# EAGLE schematic FranKinksTides-v1.4 (EAGLE 7.2.0)

## Sheet 1 of 7
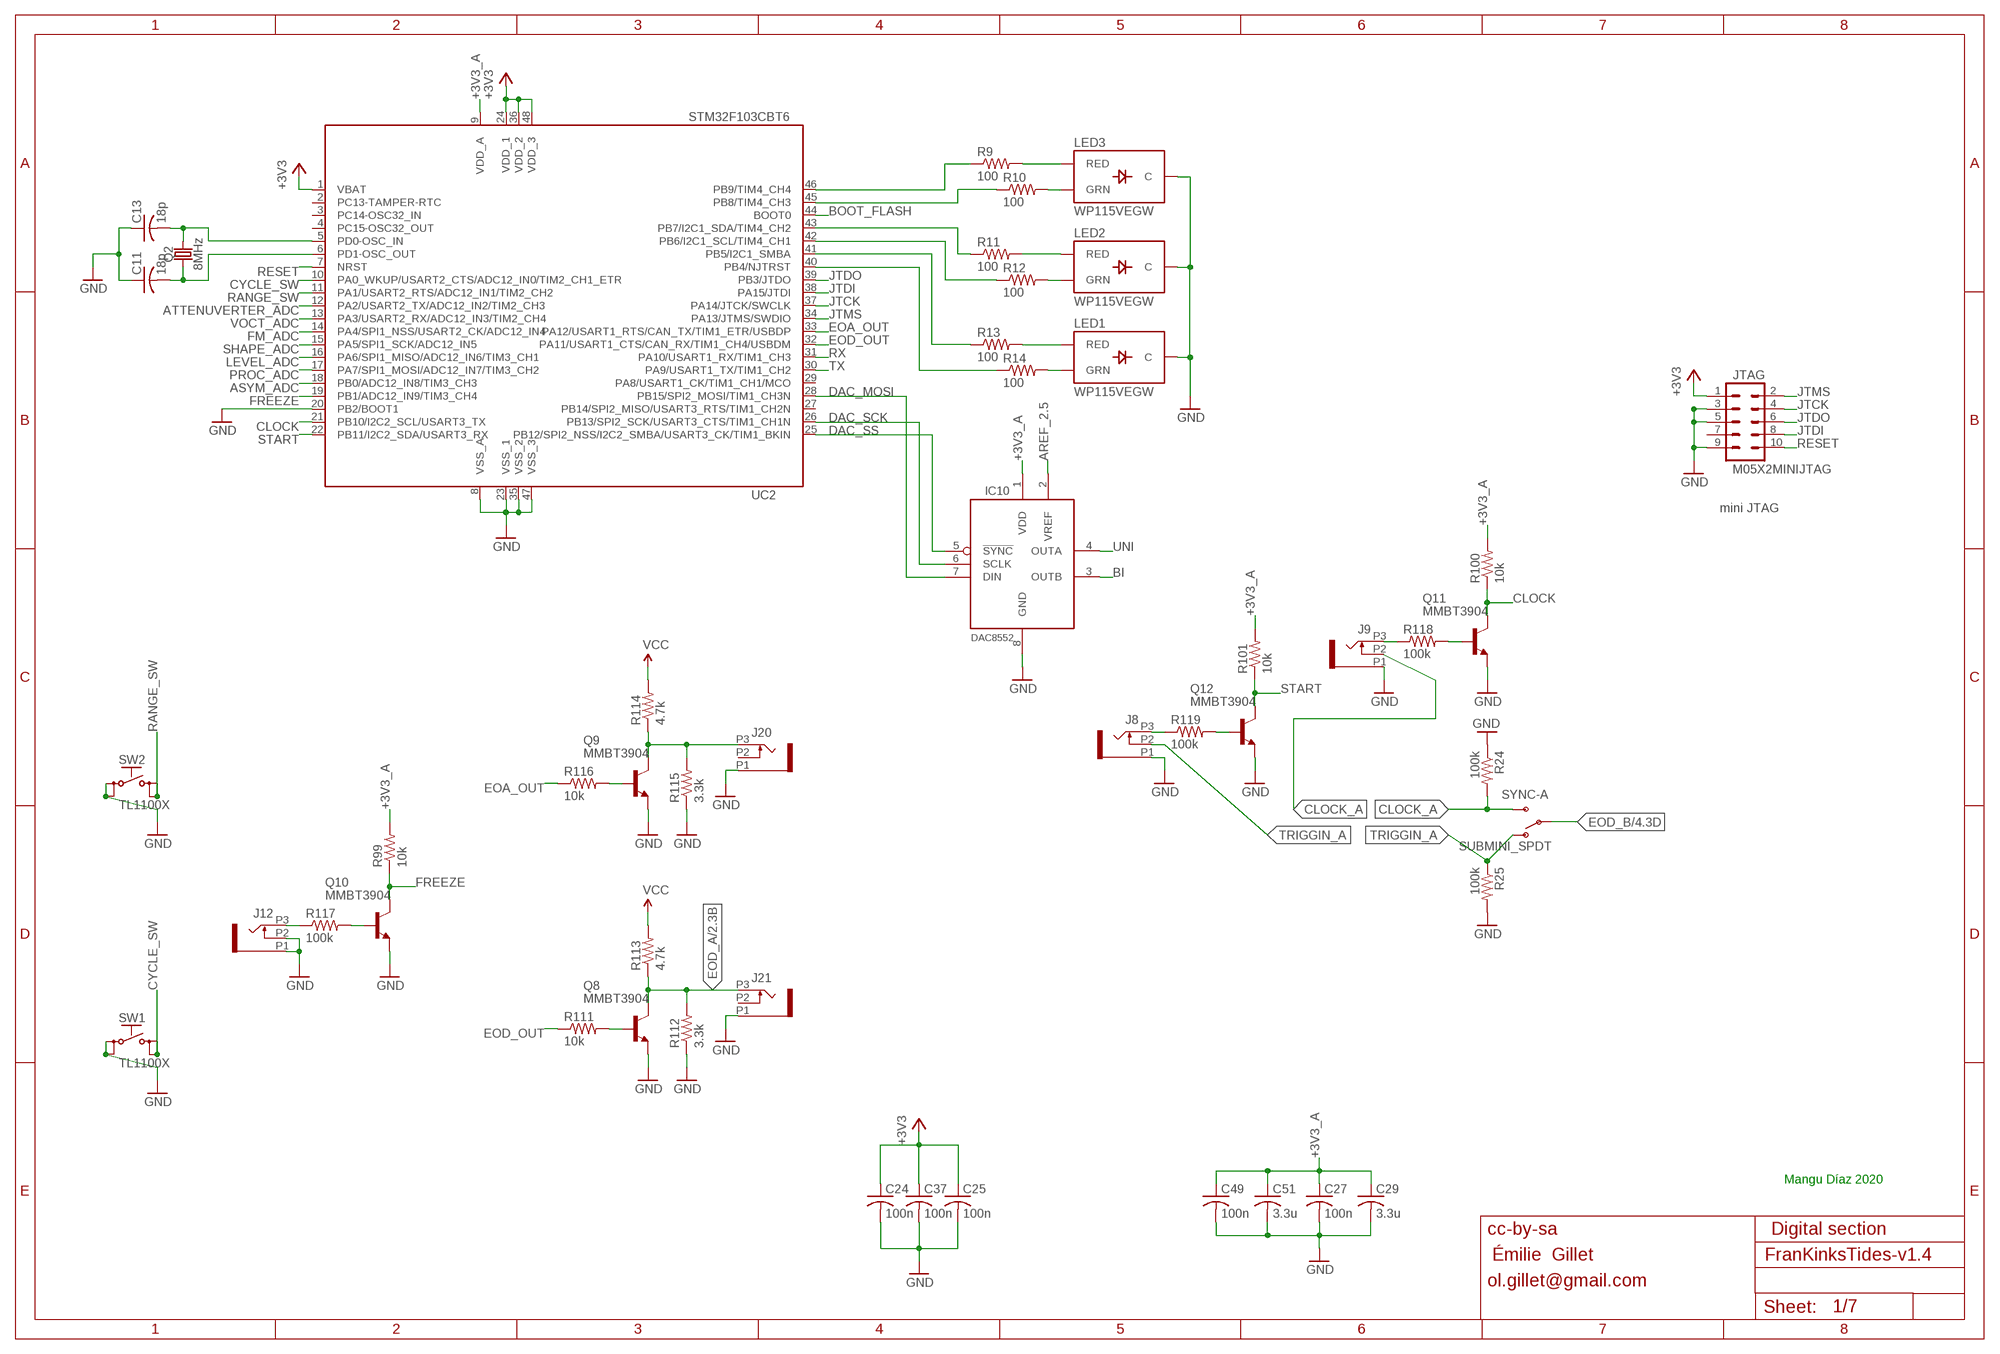
[diagram p0: schematic, sheet 1]

### Parts
C11  18p  C-USC0603  [C0603]
C13  18p  C-USC0603  [C0603]
C24  100n  C-USC0603  [C0603]
C25  100n  C-USC0603  [C0603]
C27  100n  C-USC0603  [C0603]
C29  3.3u  C-USC0603  [C0603]
C37  100n  C-USC0603  [C0603]
C49  100n  C-USC0603  [C0603]
C51  3.3u  C-USC0603  [C0603]
IC10  DAC8552  [MSOP-8]
J8  PJ301_GUI6  [OG-PJ301_VARIATIONS_WQP_PJ_301M6]
J9  PJ301_GUI6  [OG-PJ301_VARIATIONS_WQP_PJ_301M6]
J12  PJ301_GUI6  [OG-PJ301_VARIATIONS_WQP_PJ_301M6]
J20  PJ301_GUI6  [OG-PJ301_VARIATIONS_WQP_PJ_301M6]
J21  PJ301_GUI6  [OG-PJ301_VARIATIONS_WQP_PJ_301M6]
JTAG  M05X2MINIJTAG  [2X5-1.27]
LED1  WP115VEGW  LED-BICOLOR-THROUGHHOLE  [LED-BICOLOR-THROUGHHOLE]
LED2  WP115VEGW  LED-BICOLOR-THROUGHHOLE  [LED-BICOLOR-THROUGHHOLE]
LED3  WP115VEGW  LED-BICOLOR-THROUGHHOLE  [LED-BICOLOR-THROUGHHOLE]
Q2  8MHz  CRYSTAL-8MHZSMD-HC49UP  [HC49UP]
Q8  MMBT3904  MMBT3904LT1-NPN-SOT23-BEC  [SOT23-BEC]
Q9  MMBT3904  MMBT3904LT1-NPN-SOT23-BEC  [SOT23-BEC]
Q10  MMBT3904  MMBT3904LT1-NPN-SOT23-BEC  [SOT23-BEC]
Q11  MMBT3904  MMBT3904LT1-NPN-SOT23-BEC  [SOT23-BEC]
Q12  MMBT3904  MMBT3904LT1-NPN-SOT23-BEC  [SOT23-BEC]
R9  100  R-US_R0603  [R0603]
R10  100  R-US_R0603  [R0603]
R11  100  R-US_R0603  [R0603]
R12  100  R-US_R0603  [R0603]
R13  100  R-US_R0603  [R0603]
R14  100  R-US_R0603  [R0603]
R24  100k  R-US_R0603  [R0603]
R25  100k  R-US_R0603  [R0603]
R99  10k  R-US_R0603  [R0603]
R100  10k  R-US_R0603  [R0603]
R101  10k  R-US_R0603  [R0603]
R111  10k  R-US_R0603  [R0603]
R112  3.3k  R-US_R0603  [R0603]
R113  4.7k  R-US_R0603  [R0603]
R114  4.7k  R-US_R0603  [R0603]
R115  3.3k  R-US_R0603  [R0603]
R116  10k  R-US_R0603  [R0603]
R117  100k  R-US_R0603  [R0603]
R118  100k  R-US_R0603  [R0603]
R119  100k  R-US_R0603  [R0603]
SW1  TL1100X  [TL1100X]
SW2  TL1100X  [TL1100X]
SYNC-A  SUBMINI_SPDT  [SUBMINI_TOGGLE]
UC2  STM32F103CBT6  STM32F103CB  [LQFP48]

### Nets
+3V3: C24.1 C25.1 C37.1 JTAG.1 UC2.1(VBAT) UC2.24(VDD_1) UC2.36(VDD_2) UC2.48(VDD_3) ; also sheet 3,4,6
+3V3_A: C27.1 C29.1 C49.1 C51.1 IC10.1(VDD) R99.2 R100.2 R101.2 UC2.9(VDD_A) ; also sheet 2,3,4,5,6
AREF_2.5: IC10.2(VREF) ; also sheet 3,4,6
ASYM_ADC: UC2.18(PB0/ADC12_IN8/TIM3_CH3) ; also sheet 2,4,5
ATTENUVERTER_ADC: UC2.12(PA2/USART2_TX/ADC12_IN2/TIM2_CH3) ; also sheet 2,4,5
BI: IC10.3(OUTB) ; also sheet 2,4,5
BOOT_FLASH: UC2.44(BOOT0) ; also sheet 4
CLOCK: Q11.C R100.1 UC2.21(PB10/I2C2_SCL/USART3_TX) ; also sheet 4
CLOCK_A: J9.P2 R24.2 SYNC-A.3(S)
CYCLE_SW: SW1.3(S) SW1.4(S1) UC2.10(PA0_WKUP/USART2_CTS/ADC12_IN0/TIM2_CH1_ETR) ; also sheet 4
DAC_MOSI: IC10.7(DIN) UC2.28(PB15/SPI2_MOSI/TIM1_CH3N) ; also sheet 4
DAC_SCK: IC10.6(SCLK) UC2.26(PB13/SPI2_SCK/USART3_CTS/TIM1_CH1N) ; also sheet 4
DAC_SS: IC10.5(!SYNC) UC2.25(PB12/SPI2_NSS/I2C2_SMBA/USART3_CK/TIM1_BKIN) ; also sheet 4
EOA_OUT: R116.1 UC2.33(PA12/USART1_RTS/CAN_TX/TIM1_ETR/USBDP) ; also sheet 4
EOD_A: J21.P3 Q8.C R112.2 R113.1 ; also sheet 2
EOD_B: SYNC-A.COM(COMMON) ; also sheet 4
EOD_OUT: R111.1 UC2.32(PA11/USART1_CTS/CAN_RX/TIM1_CH4/USBDM) ; also sheet 4
FM_ADC: UC2.14(PA4/SPI1_NSS/USART2_CK/ADC12_IN4) ; also sheet 2,4,5
FREEZE: Q10.C R99.1 UC2.19(PB1/ADC12_IN9/TIM3_CH4) ; also sheet 4
GND: C11.1 C13.1 C24.2 C25.2 C27.2 C29.2 C37.2 C49.2 C51.2 IC10.8(GND) J8.P1 J9.P1 J12.P1 J12.P2 J20.P1 J21.P1 JTAG.3 JTAG.5 JTAG.9 LED1.2(C) LED2.2(C) LED3.2(C) Q8.E Q9.E Q10.E Q11.E Q12.E R24.1 R25.2 R112.1 R115.1 SW1.1(P) SW1.2(P1) SW2.1(P) SW2.2(P1) UC2.8(VSS_A) UC2.20(PB2/BOOT1) UC2.23(VSS_1) UC2.35(VSS_2) UC2.47(VSS_3) ; also sheet 2,3,4,5,6,7
JTCK: JTAG.4 UC2.37(PA14/JTCK/SWCLK) ; also sheet 4
JTDI: JTAG.8 UC2.38(PA15/JTDI) ; also sheet 4
JTDO: JTAG.6 UC2.39(PB3/JTDO) ; also sheet 4
JTMS: JTAG.2 UC2.34(PA13/JTMS/SWDIO) ; also sheet 4
LEVEL_ADC: UC2.16(PA6/SPI1_MISO/ADC12_IN6/TIM3_CH1) ; also sheet 2,4,5
N$7: C13.2 Q2.2 UC2.5(PD0-OSC_IN)
N$8: C11.2 Q2.1 UC2.6(PD1-OSC_OUT)
N$18: J8.P3 R119.1
N$21: J12.P3 R117.1
N$23: Q10.B R117.2
N$24: J9.P3 R118.1
N$25: Q11.B R118.2
N$26: Q8.B R111.2
N$28: LED3.3(RED) R9.2
N$29: LED3.1(GRN) R10.2
N$30: LED2.3(RED) R11.2
N$31: LED2.1(GRN) R12.2
N$32: LED1.3(RED) R13.2
N$33: LED1.1(GRN) R14.2
N$34: R9.1 UC2.46(PB9/TIM4_CH4)
N$35: R10.1 UC2.45(PB8/TIM4_CH3)
N$36: R11.1 UC2.43(PB7/I2C1_SDA/TIM4_CH2)
N$37: R12.1 UC2.42(PB6/I2C1_SCL/TIM4_CH1)
N$38: R13.1 UC2.41(PB5/I2C1_SMBA)
N$39: R14.1 UC2.40(PB4/NJTRST)
N$44: J20.P3 Q9.C R114.1 R115.2
N$47: Q9.B R116.2
N$66: Q12.B R119.2
PROC_ADC: UC2.17(PA7/SPI1_MOSI/ADC12_IN7/TIM3_CH2) ; also sheet 2,4,5
RANGE_SW: SW2.3(S) SW2.4(S1) UC2.11(PA1/USART2_RTS/ADC12_IN1/TIM2_CH2) ; also sheet 4
RESET: JTAG.10 UC2.7(NRST) ; also sheet 4
RX: UC2.31(PA10/USART1_RX/TIM1_CH3) ; also sheet 4
SHAPE_ADC: UC2.15(PA5/SPI1_SCK/ADC12_IN5) ; also sheet 2,4,5
START: Q12.C R101.1 UC2.22(PB11/I2C2_SDA/USART3_RX) ; also sheet 4
TRIGGIN_A: J8.P2 R25.1 SYNC-A.1(O)
TX: UC2.30(PA9/USART1_TX/TIM1_CH2) ; also sheet 4
UNI: IC10.4(OUTA) ; also sheet 2,4,5
VCC: R113.2 R114.2 ; also sheet 2,3,4,5,6,7
VOCT_ADC: UC2.13(PA3/USART2_RX/ADC12_IN3/TIM2_CH4) ; also sheet 2,4,5
Unconnected: J20.P2 J21.P2 JTAG.7 UC2.2(PC13-TAMPER-RTC) UC2.3(PC14-OSC32_IN) UC2.4(PC15-OSC32_OUT) UC2.27(PB14/SPI2_MISO/USART3_RTS/TIM1_CH2N) UC2.29(PA8/USART1_CK/TIM1_CH1/MCO)

### Notes on the sheet
- mini JTAG
- Mangu Díaz 2020
- cc-by-sa | Digital section
- Émilie  Gillet
- ol.gillet@gmail.com

## Sheet 2 of 7
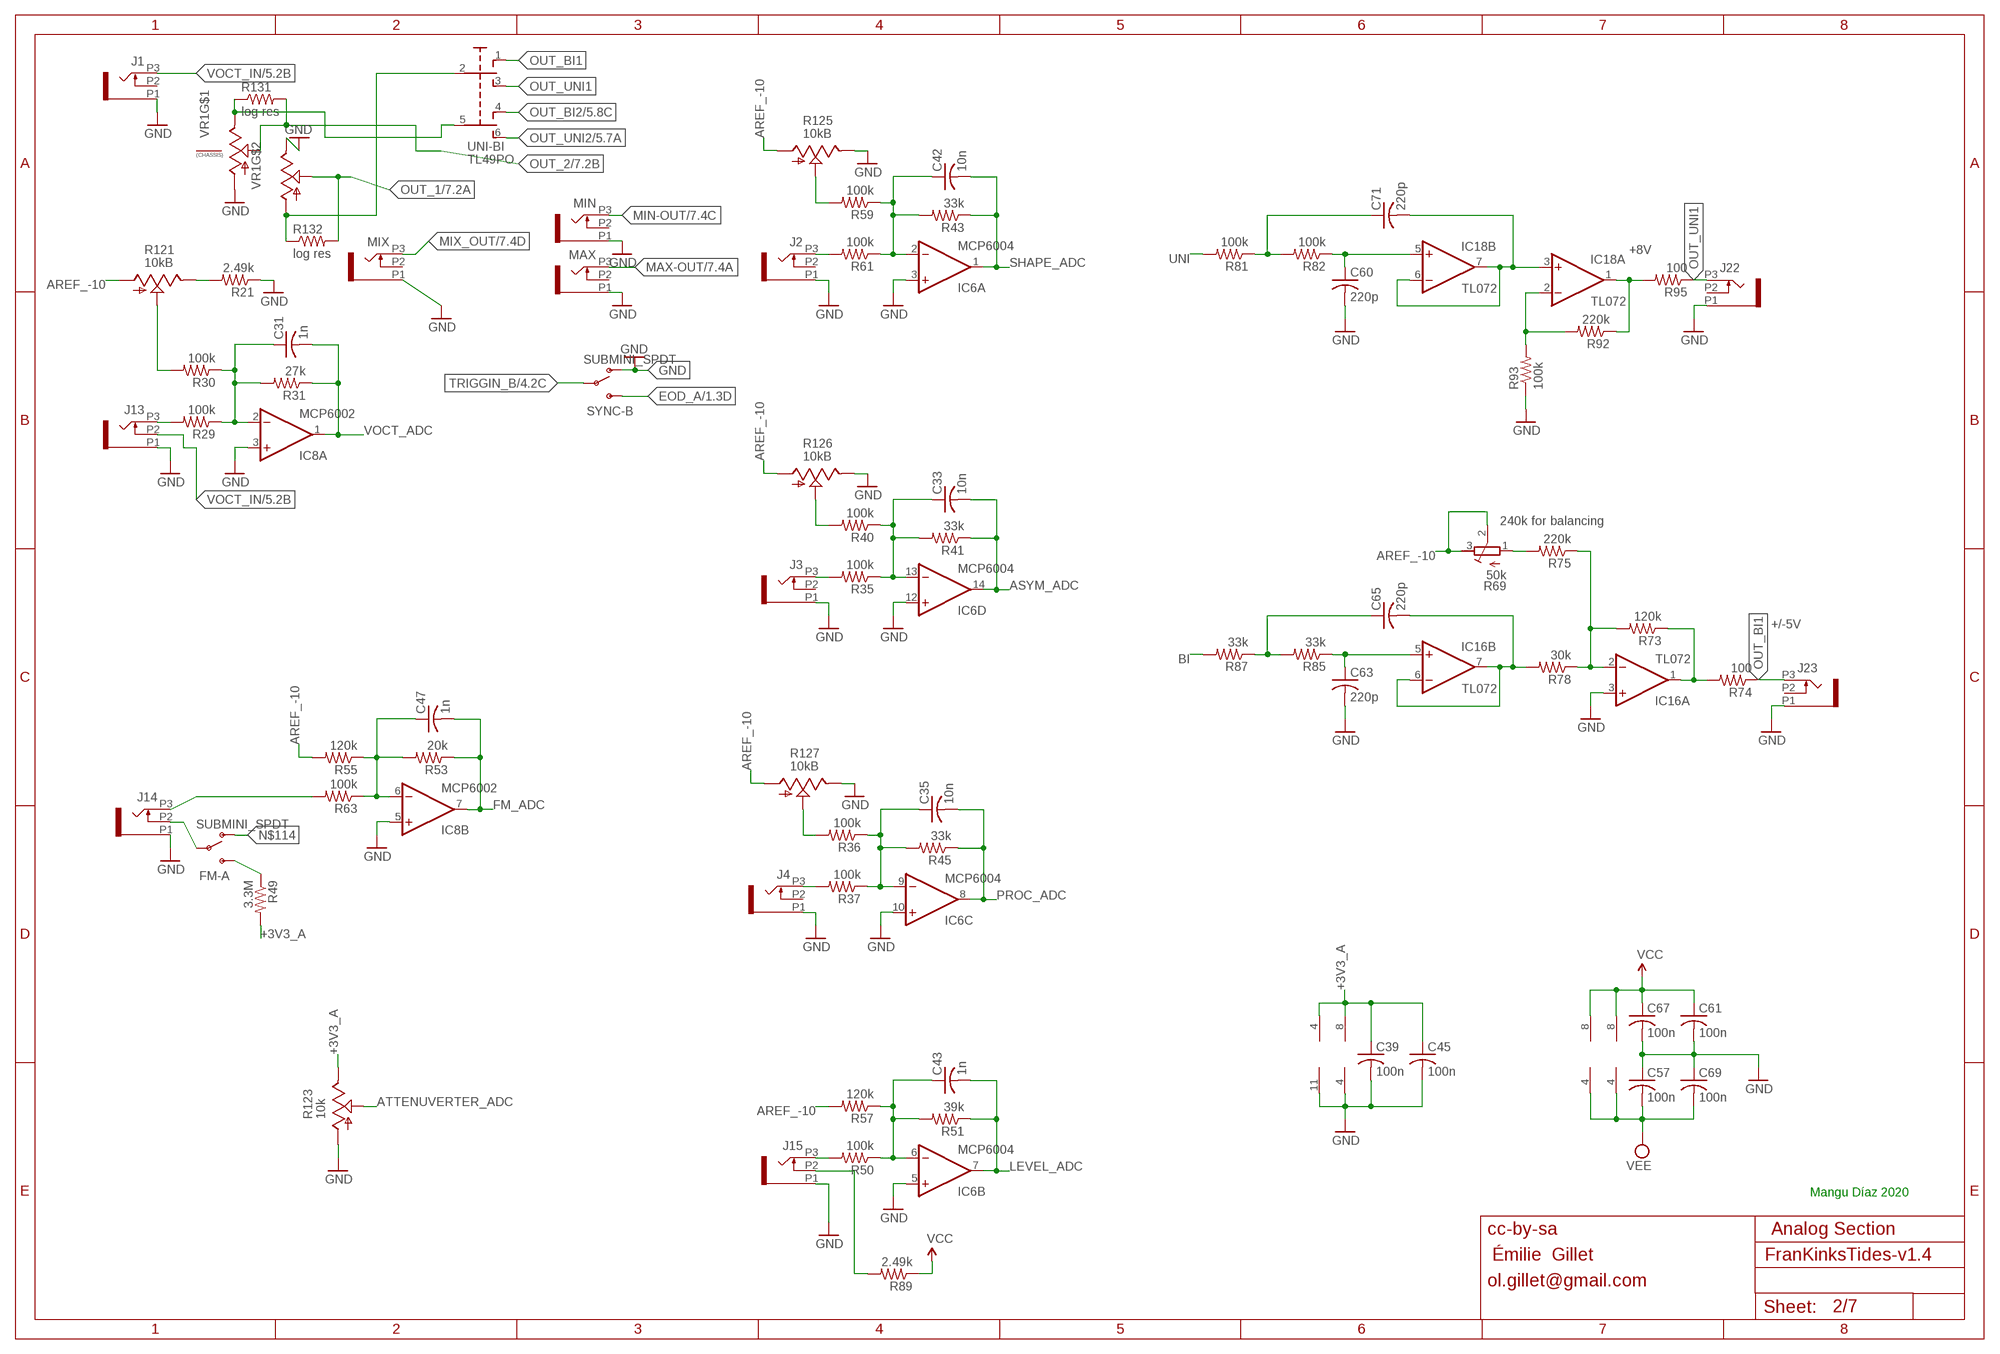
[diagram p1: schematic, sheet 2]

### Parts
C31  1n  C-USC0603  [C0603]
C33  10n  C-USC0603  [C0603]
C35  10n  C-USC0603  [C0603]
C39  100n  C-USC0603  [C0603]
C42  10n  C-USC0603  [C0603]
C43  1n  C-USC0603  [C0603]
C45  100n  C-USC0603  [C0603]
C47  1n  C-USC0603  [C0603]
C57  100n  C-USC0603  [C0603]
C60  220p  C-USC0603  [C0603]
C61  100n  C-USC0603  [C0603]
C63  220p  C-USC0603  [C0603]
C65  220p  C-USC0603  [C0603]
C67  100n  C-USC0603  [C0603]
C69  100n  C-USC0603  [C0603]
C71  220p  C-USC0603  [C0603]
FM-A  SUBMINI_SPDT  [SUBMINI_TOGGLE]
IC6  MCP6004  MCP6004ST  [TSSOP14]
IC8  MCP6002  TL072D  [SO08]
IC16  TL072  TL072TSSOP  [TSSOP-8]
IC18  TL072  TL072TSSOP  [TSSOP-8]
J1  PJ301_GUI6  [OG-PJ301_VARIATIONS_WQP_PJ_301M6]
J2  PJ301_GUI6  [OG-PJ301_VARIATIONS_WQP_PJ_301M6]
J3  PJ301_GUI6  [OG-PJ301_VARIATIONS_WQP_PJ_301M6]
J4  PJ301_GUI6  [OG-PJ301_VARIATIONS_WQP_PJ_301M6]
J13  PJ301_GUI6  [OG-PJ301_VARIATIONS_WQP_PJ_301M6]
J14  PJ301_GUI6  [OG-PJ301_VARIATIONS_WQP_PJ_301M6]
J15  PJ301_GUI6  [OG-PJ301_VARIATIONS_WQP_PJ_301M6]
J22  PJ301_GUI6  [OG-PJ301_VARIATIONS_WQP_PJ_301M6]
J23  PJ301_GUI6  [OG-PJ301_VARIATIONS_WQP_PJ_301M6]
MAX  PJ301_GUI6  [OG-PJ301_VARIATIONS_WQP_PJ_301M6]
MIN  PJ301_GUI6  [OG-PJ301_VARIATIONS_WQP_PJ_301M6]
MIX  PJ301_GUI6  [OG-PJ301_VARIATIONS_WQP_PJ_301M6]
R21  2.49k  R-US_R0603  [R0603]
R29  100k  R-US_R0603  [R0603]
R30  100k  R-US_R0603  [R0603]
R31  27k  R-US_R0603  [R0603]
R35  100k  R-US_R0603  [R0603]
R36  100k  R-US_R0603  [R0603]
R37  100k  R-US_R0603  [R0603]
R40  100k  R-US_R0603  [R0603]
R41  33k  R-US_R0603  [R0603]
R43  33k  R-US_R0603  [R0603]
R45  33k  R-US_R0603  [R0603]
R49  3.3M  R-US_R0603  [R0603]
R50  100k  R-US_R0603  [R0603]
R51  39k  R-US_R0603  [R0603]
R53  20k  R-US_R0603  [R0603]
R55  120k  R-US_R0603  [R0603]
R57  120k  R-US_R0603  [R0603]
R59  100k  R-US_R0603  [R0603]
R61  100k  R-US_R0603  [R0603]
R63  100k  R-US_R0603  [R0603]
R69  50k  R-TRIMM3296W  [RTRIM3296W]
R73  120k  R-US_R0603  [R0603]
R74  100  R-US_R0603  [R0603]
R75  220k  R-US_R0603  [R0603]
R78  30k  R-US_R0603  [R0603]
R81  100k  R-US_R0603  [R0603]
R82  100k  R-US_R0603  [R0603]
R85  33k  R-US_R0603  [R0603]
R87  33k  R-US_R0603  [R0603]
R89  2.49k  R-US_R0805  [R0805]
R92  220k  R-US_R0603  [R0603]
R93  100k  R-US_R0603  [R0603]
R95  100  R-US_R0603  [R0603]
R121  10kB  POT_USVERTICAL_PS  [ALPS_POT_VERTICAL_PS]
R123  10k  POT-ALPS_POT_US  [TALLTRIMMER]
R125  10kB  POT-ALPS_POT_US  [TALLTRIMMER]
R126  10kB  POT-ALPS_POT_US  [TALLTRIMMER]
R127  10kB  POT-ALPS_POT_US  [TALLTRIMMER]
R131  log res  R-US_R0603  [R0603]
R132  log res  R-US_R0603  [R0603]
SYNC-B  SUBMINI_SPDT  [SUBMINI_TOGGLE]
UNI-BI  TL49PO  [TL4XPO]
VR1  ALPHA-9MM-DUALPOT  [DUAL_9MM_SNAP-IN_POT]

### Nets
+3V3_A: C39.1 C45.1 IC6.4(P:V+) IC8.8(P:V+) R49.2 R123.P$1(E) ; also sheet 1,3,4,5,6
AREF_-10: R55.2 R57.2 R69.2(S) R69.3(E) R121.P$3(A) R125.P$3(A) R126.P$3(A) R127.P$3(A) ; also sheet 3,5,6
ASYM_ADC: C33.2 IC6.14(D:OUT) R41.1 ; also sheet 1,4,5
ATTENUVERTER_ADC: R123.P$2(S) ; also sheet 1,4,5
BI: R87.2 ; also sheet 1,4,5
BI_OUT: IC16.1(A:OUT) R73.1 R74.2
EOD_A: SYNC-B.3(S) ; also sheet 1
F_CV: IC16.2(A:-IN) R73.2 R75.1 R78.1
FM_ADC: C47.2 IC8.7(B:OUT) R53.1 ; also sheet 1,4,5
GND: C39.2 C45.2 C57.1 C60.2 C61.2 C63.2 C67.2 C69.1 IC6.3(A:+IN) IC6.5(B:+IN) IC6.10(C:+IN) IC6.11(P:V-) IC6.12(D:+IN) IC8.3(A:+IN) IC8.4(P:V-) IC8.5(B:+IN) IC16.3(A:+IN) J1.P1 J2.P1 J3.P1 J4.P1 J13.P1 J14.P1 J15.P1 J22.P1 J23.P1 MAX.P1 MIN.P1 MIX.P1 R21.1 R93.1 R123.P$3(A) R125.P$1(E) R126.P$1(E) R127.P$1(E) SYNC-B.1(O) VR1.1(A) VR1.3B(E) ; also sheet 1,3,4,5,6,7
LEVEL_ADC: C43.2 IC6.7(B:OUT) R51.1 ; also sheet 1,4,5
MAX-OUT: MAX.P3 ; also sheet 7
MIN-OUT: MIN.P3 ; also sheet 7
MIX_OUT: MIX.P3 ; also sheet 7
N$1: J2.P3 R61.2
N$2: C42.1 IC6.2(A:-IN) R43.2 R59.1 R61.1
N$3: R59.2 R125.P$2(S)
N$4: J3.P3 R35.2
N$5: C33.1 IC6.13(D:-IN) R35.1 R40.1 R41.2
N$6: FM-A.3(S) R49.1
N$9: R40.2 R126.P$2(S)
N$10: J4.P3 R37.2
N$11: C35.1 IC6.9(C:-IN) R36.1 R37.1 R45.2
N$12: R36.2 R127.P$2(S)
N$13: J15.P3 R50.2
N$14: C43.1 IC6.6(B:-IN) R50.1 R51.2 R57.1
N$15: J13.P3 R29.2
N$16: C31.1 IC8.2(A:-IN) R29.1 R30.1 R31.2
N$17: R30.2 R121.P$2(S)
N$19: R21.2 R121.P$1(E)
N$20: J14.P3 R63.2
N$22: C47.1 IC8.6(B:-IN) R53.2 R55.1 R63.1
N$27: FM-A.COM(COMMON) J14.P2
N$40: R69.1(A) R75.2
N$41: IC18.2(A:-IN) R92.2 R93.2
N$42: C65.2 IC16.6(B:-IN) IC16.7(B:OUT) R78.2
N$43: C63.1 IC16.5(B:+IN) R85.1
N$45: C65.1 R85.2 R87.1
N$46: IC18.1(A:OUT) R92.1 R95.2
N$48: J15.P2 R89.2
N$67: C71.2 IC18.3(A:+IN) IC18.6(B:-IN) IC18.7(B:OUT)
N$69: C60.1 IC18.5(B:+IN) R82.1
N$71: C71.1 R81.1 R82.2
N$114: FM-A.1(O) R131.1 UNI-BI.5(P1) VR1.3(E)
N$116: R132.1 UNI-BI.2(P) VR1.1B(A)
OUT_1: R132.2 VR1.2B(S) ; also sheet 7
OUT_2: R131.2 VR1.2(S) ; also sheet 7
OUT_BI1: J23.P3 R74.1 UNI-BI.1(O)
OUT_BI2: UNI-BI.4(O1) ; also sheet 5
OUT_UNI1: J22.P3 R95.1 UNI-BI.3(S)
OUT_UNI2: UNI-BI.6(S1) ; also sheet 5
PROC_ADC: C35.2 IC6.8(C:OUT) R45.1 ; also sheet 1,4,5
SHAPE_ADC: C42.2 IC6.1(A:OUT) R43.1 ; also sheet 1,4,5
TRIGGIN_B: SYNC-B.COM(COMMON) ; also sheet 4
UNI: R81.2 ; also sheet 1,4,5
VCC: C61.1 C67.1 IC16.8(P:V+) IC18.8(P:V+) R89.1 ; also sheet 1,3,4,5,6,7
VEE: C57.2 C69.2 IC16.4(P:V-) IC18.4(P:V-) ; also sheet 3,5,6,7
VOCT_ADC: C31.2 IC8.1(A:OUT) R31.1 ; also sheet 1,4,5
VOCT_IN: J1.P3 J13.P2 ; also sheet 5
Unconnected: J1.P2 J2.P2 J3.P2 J4.P2 J22.P2 J23.P2 MAX.P2 MIN.P2 MIX.P2 VR1.CHASSIS1 VR1.CHASSIS2

### Notes on the sheet
- +8V
- 240k for balancing
- +/-5V
- Mangu Díaz 2020
- cc-by-sa | Analog Section
- Émilie  Gillet
- ol.gillet@gmail.com

## Sheet 3 of 7
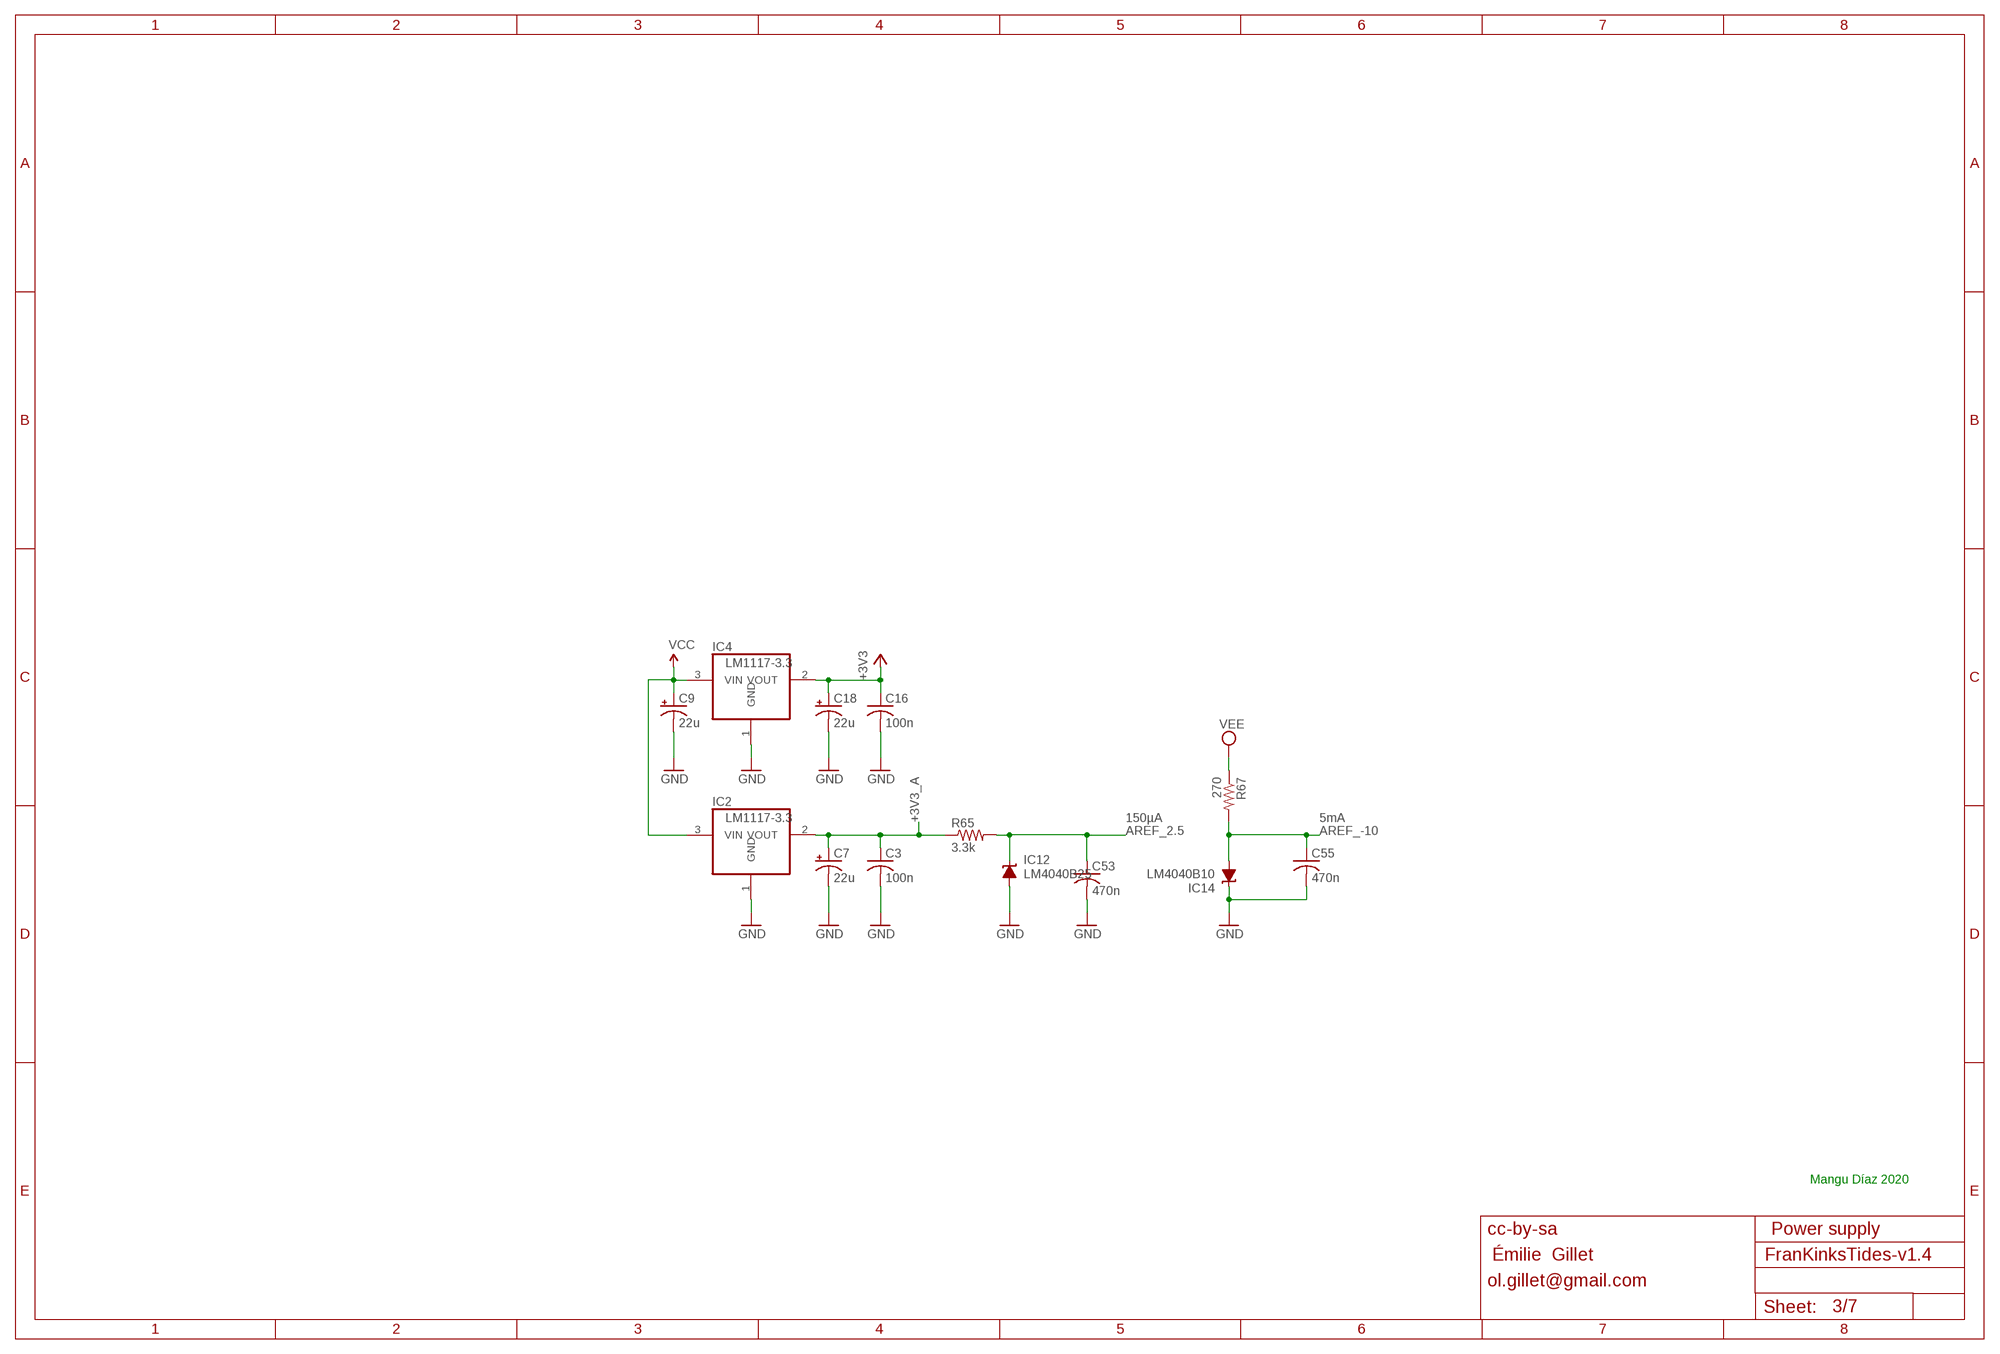
[diagram p2: schematic, sheet 3]

### Parts
C3  100n  C-USC0603  [C0603]
C7  22u  CPOL-USD  [PANASONIC_D]
C9  22u  CPOL-USD  [PANASONIC_D]
C16  100n  C-USC0603  [C0603]
C18  22u  CPOL-USD  [PANASONIC_D]
C53  470n  C-USC0603  [C0603]
C55  470n  C-USC0603  [C0603]
IC2  LM1117-3.3  REG1117  [SOT223]
IC4  LM1117-3.3  REG1117  [SOT223]
IC12  LM4040B25  LM4041B12DBZ  [DBZ_R-PDSO-G3]
IC14  LM4040B10  LM4041B12DBZ  [DBZ_R-PDSO-G3]
R65  3.3k  R-US_R0603  [R0603]
R67  270  R-US_R0603  [R0603]

### Nets
+3V3: C16.1 C18.+ IC4.2(VOUT) ; also sheet 1,4,6
+3V3_A: C3.1 C7.+ IC2.2(VOUT) R65.1 ; also sheet 1,2,4,5,6
AREF_2.5: C53.1 IC12.1(C) R65.2 ; also sheet 1,4,6
AREF_-10: C55.1 IC14.2(A) R67.2 ; also sheet 2,5,6
GND: C3.2 C7.- C9.- C16.2 C18.- C53.2 C55.2 IC2.1(GND) IC4.1(GND) IC12.2(A) IC14.1(C) ; also sheet 1,2,4,5,6,7
VCC: C9.+ IC2.3(VIN) IC4.3(VIN) ; also sheet 1,2,4,5,6,7
VEE: R67.1 ; also sheet 2,5,6,7

### Notes on the sheet
- 150µA | 5mA
- Mangu Díaz 2020
- cc-by-sa | Power supply
- Émilie  Gillet
- ol.gillet@gmail.com

## Sheet 4 of 7
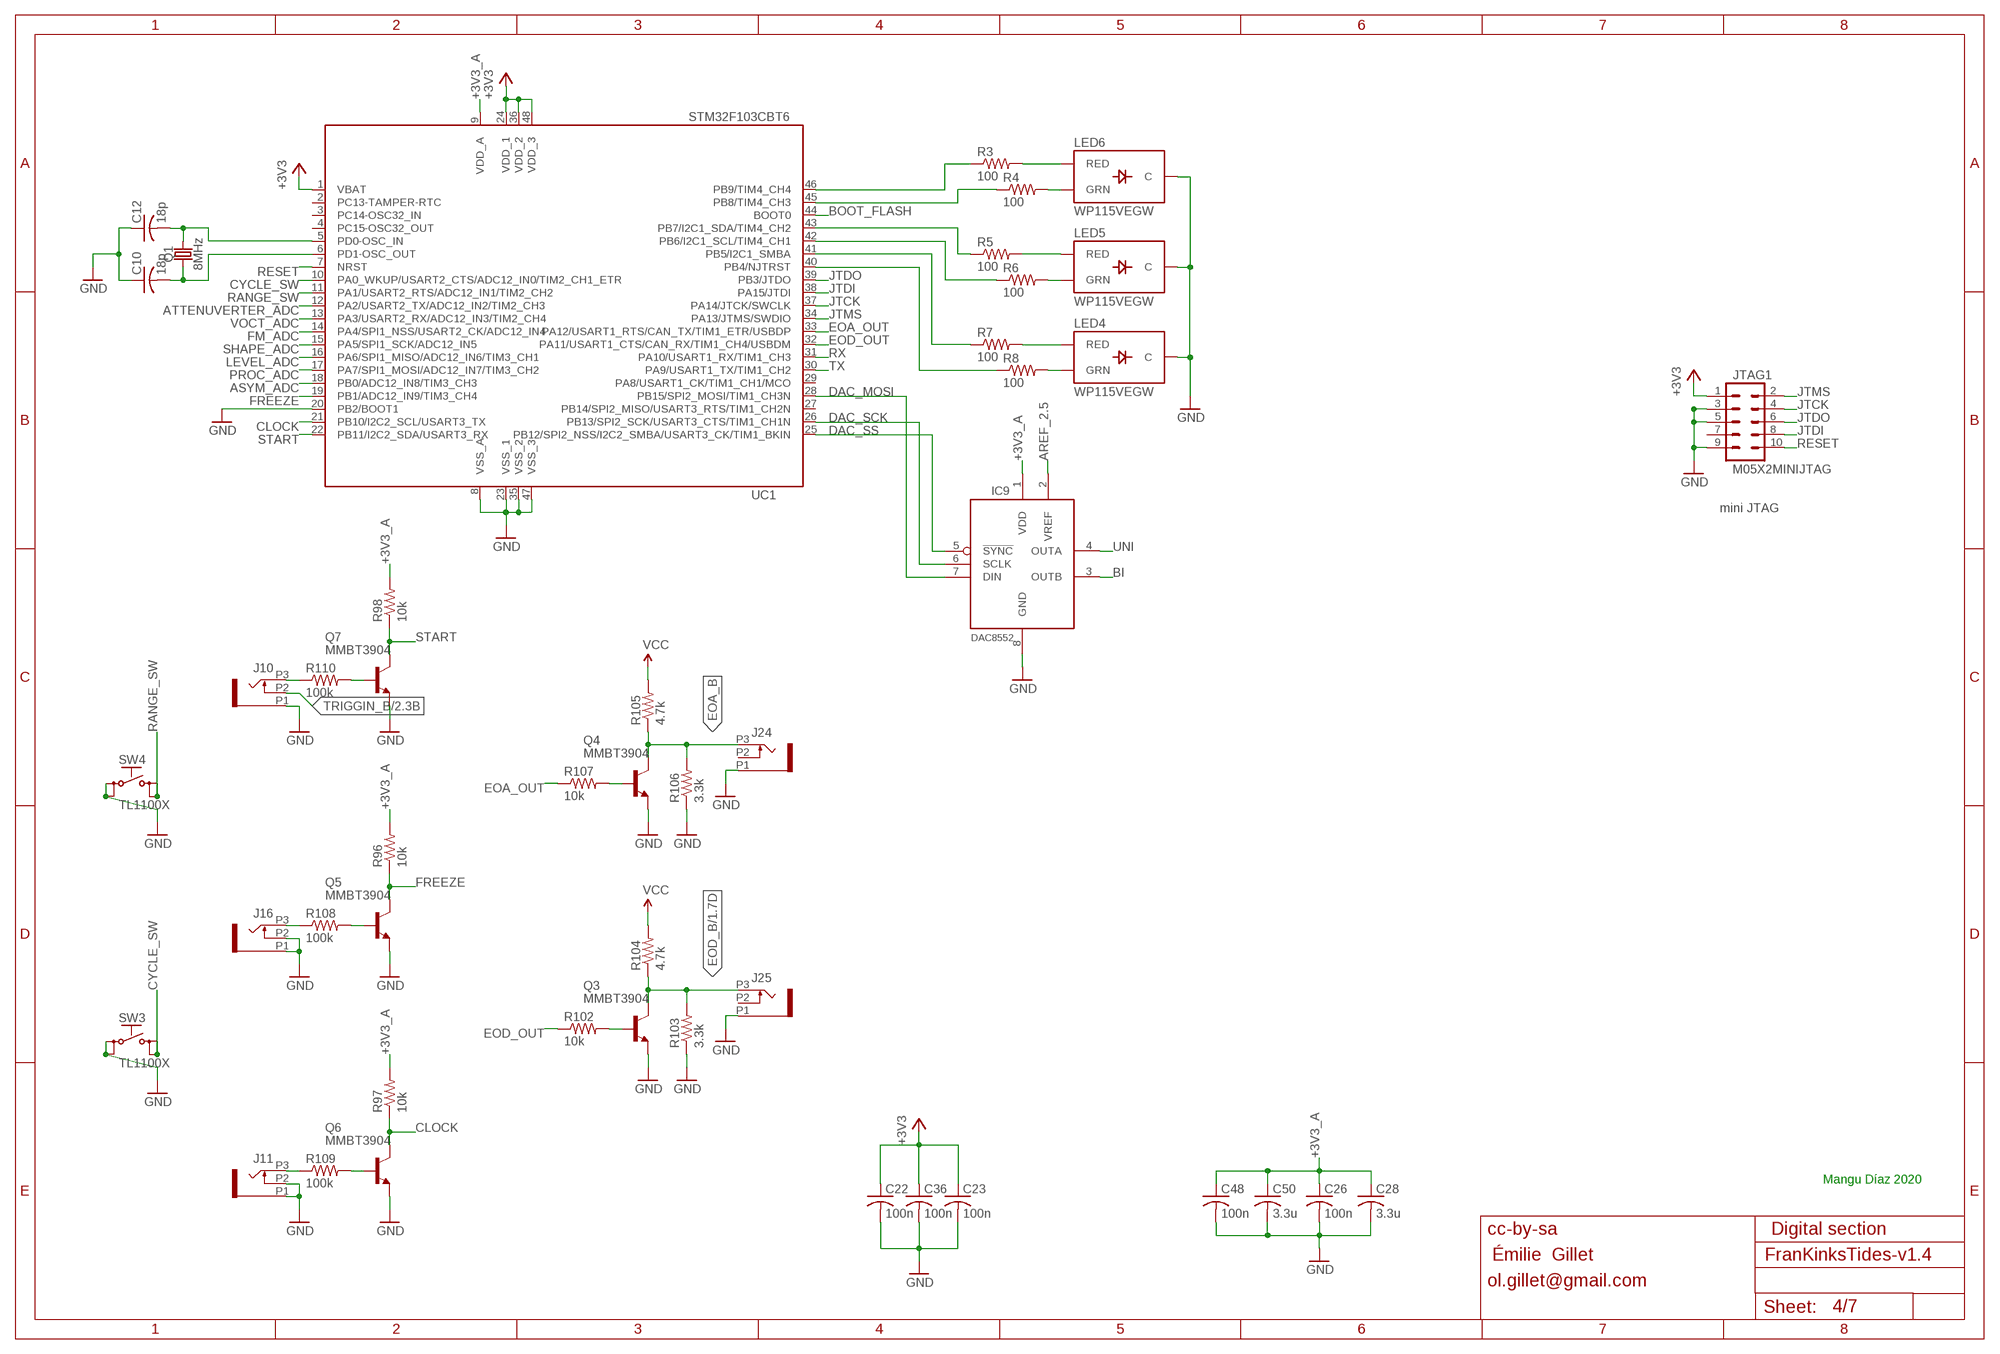
[diagram p3: schematic, sheet 4]

### Parts
C10  18p  C-USC0603  [C0603]
C12  18p  C-USC0603  [C0603]
C22  100n  C-USC0603  [C0603]
C23  100n  C-USC0603  [C0603]
C26  100n  C-USC0603  [C0603]
C28  3.3u  C-USC0603  [C0603]
C36  100n  C-USC0603  [C0603]
C48  100n  C-USC0603  [C0603]
C50  3.3u  C-USC0603  [C0603]
IC9  DAC8552  [MSOP-8]
J10  PJ301_GUI6  [OG-PJ301_VARIATIONS_WQP_PJ_301M6]
J11  PJ301_GUI6  [OG-PJ301_VARIATIONS_WQP_PJ_301M6]
J16  PJ301_GUI6  [OG-PJ301_VARIATIONS_WQP_PJ_301M6]
J24  PJ301_GUI6  [OG-PJ301_VARIATIONS_WQP_PJ_301M6]
J25  PJ301_GUI6  [OG-PJ301_VARIATIONS_WQP_PJ_301M6]
JTAG1  M05X2MINIJTAG  [2X5-1.27]
LED4  WP115VEGW  LED-BICOLOR-THROUGHHOLE  [LED-BICOLOR-THROUGHHOLE]
LED5  WP115VEGW  LED-BICOLOR-THROUGHHOLE  [LED-BICOLOR-THROUGHHOLE]
LED6  WP115VEGW  LED-BICOLOR-THROUGHHOLE  [LED-BICOLOR-THROUGHHOLE]
Q1  8MHz  CRYSTAL-8MHZSMD-HC49UP  [HC49UP]
Q3  MMBT3904  MMBT3904LT1-NPN-SOT23-BEC  [SOT23-BEC]
Q4  MMBT3904  MMBT3904LT1-NPN-SOT23-BEC  [SOT23-BEC]
Q5  MMBT3904  MMBT3904LT1-NPN-SOT23-BEC  [SOT23-BEC]
Q6  MMBT3904  MMBT3904LT1-NPN-SOT23-BEC  [SOT23-BEC]
Q7  MMBT3904  MMBT3904LT1-NPN-SOT23-BEC  [SOT23-BEC]
R3  100  R-US_R0603  [R0603]
R4  100  R-US_R0603  [R0603]
R5  100  R-US_R0603  [R0603]
R6  100  R-US_R0603  [R0603]
R7  100  R-US_R0603  [R0603]
R8  100  R-US_R0603  [R0603]
R96  10k  R-US_R0603  [R0603]
R97  10k  R-US_R0603  [R0603]
R98  10k  R-US_R0603  [R0603]
R102  10k  R-US_R0603  [R0603]
R103  3.3k  R-US_R0603  [R0603]
R104  4.7k  R-US_R0603  [R0603]
R105  4.7k  R-US_R0603  [R0603]
R106  3.3k  R-US_R0603  [R0603]
R107  10k  R-US_R0603  [R0603]
R108  100k  R-US_R0603  [R0603]
R109  100k  R-US_R0603  [R0603]
R110  100k  R-US_R0603  [R0603]
SW3  TL1100X  [TL1100X]
SW4  TL1100X  [TL1100X]
UC1  STM32F103CBT6  STM32F103CB  [LQFP48]

### Nets
+3V3: C22.1 C23.1 C36.1 JTAG1.1 UC1.1(VBAT) UC1.24(VDD_1) UC1.36(VDD_2) UC1.48(VDD_3) ; also sheet 1,3,6
+3V3_A: C26.1 C28.1 C48.1 C50.1 IC9.1(VDD) R96.2 R97.2 R98.2 UC1.9(VDD_A) ; also sheet 1,2,3,5,6
AREF_2.5: IC9.2(VREF) ; also sheet 1,3,6
ASYM_ADC: UC1.18(PB0/ADC12_IN8/TIM3_CH3) ; also sheet 1,2,5
ATTENUVERTER_ADC: UC1.12(PA2/USART2_TX/ADC12_IN2/TIM2_CH3) ; also sheet 1,2,5
BI: IC9.3(OUTB) ; also sheet 1,2,5
BOOT_FLASH: UC1.44(BOOT0) ; also sheet 1
CLOCK: Q6.C R97.1 UC1.21(PB10/I2C2_SCL/USART3_TX) ; also sheet 1
CYCLE_SW: SW3.3(S) SW3.4(S1) UC1.10(PA0_WKUP/USART2_CTS/ADC12_IN0/TIM2_CH1_ETR) ; also sheet 1
DAC_MOSI: IC9.7(DIN) UC1.28(PB15/SPI2_MOSI/TIM1_CH3N) ; also sheet 1
DAC_SCK: IC9.6(SCLK) UC1.26(PB13/SPI2_SCK/USART3_CTS/TIM1_CH1N) ; also sheet 1
DAC_SS: IC9.5(!SYNC) UC1.25(PB12/SPI2_NSS/I2C2_SMBA/USART3_CK/TIM1_BKIN) ; also sheet 1
EOA_B: J24.P3 Q4.C R105.1 R106.2
EOA_OUT: R107.1 UC1.33(PA12/USART1_RTS/CAN_TX/TIM1_ETR/USBDP) ; also sheet 1
EOD_B: J25.P3 Q3.C R103.2 R104.1 ; also sheet 1
EOD_OUT: R102.1 UC1.32(PA11/USART1_CTS/CAN_RX/TIM1_CH4/USBDM) ; also sheet 1
FM_ADC: UC1.14(PA4/SPI1_NSS/USART2_CK/ADC12_IN4) ; also sheet 1,2,5
FREEZE: Q5.C R96.1 UC1.19(PB1/ADC12_IN9/TIM3_CH4) ; also sheet 1
GND: C10.1 C12.1 C22.2 C23.2 C26.2 C28.2 C36.2 C48.2 C50.2 IC9.8(GND) J10.P1 J11.P1 J11.P2 J16.P1 J16.P2 J24.P1 J25.P1 JTAG1.3 JTAG1.5 JTAG1.9 LED4.2(C) LED5.2(C) LED6.2(C) Q3.E Q4.E Q5.E Q6.E Q7.E R103.1 R106.1 SW3.1(P) SW3.2(P1) SW4.1(P) SW4.2(P1) UC1.8(VSS_A) UC1.20(PB2/BOOT1) UC1.23(VSS_1) UC1.35(VSS_2) UC1.47(VSS_3) ; also sheet 1,2,3,5,6,7
JTCK: JTAG1.4 UC1.37(PA14/JTCK/SWCLK) ; also sheet 1
JTDI: JTAG1.8 UC1.38(PA15/JTDI) ; also sheet 1
JTDO: JTAG1.6 UC1.39(PB3/JTDO) ; also sheet 1
JTMS: JTAG1.2 UC1.34(PA13/JTMS/SWDIO) ; also sheet 1
LEVEL_ADC: UC1.16(PA6/SPI1_MISO/ADC12_IN6/TIM3_CH1) ; also sheet 1,2,5
N$49: C12.2 Q1.2 UC1.5(PD0-OSC_IN)
N$50: C10.2 Q1.1 UC1.6(PD1-OSC_OUT)
N$51: Q4.B R107.2
N$53: Q3.B R102.2
N$55: LED6.3(RED) R3.2
N$58: LED6.1(GRN) R4.2
N$59: LED5.3(RED) R5.2
N$60: LED5.1(GRN) R6.2
N$61: LED4.3(RED) R7.2
N$62: LED4.1(GRN) R8.2
N$63: R3.1 UC1.46(PB9/TIM4_CH4)
N$65: R4.1 UC1.45(PB8/TIM4_CH3)
N$68: R5.1 UC1.43(PB7/I2C1_SDA/TIM4_CH2)
N$70: R6.1 UC1.42(PB6/I2C1_SCL/TIM4_CH1)
N$72: R7.1 UC1.41(PB5/I2C1_SMBA)
N$73: R8.1 UC1.40(PB4/NJTRST)
N$74: J10.P3 R110.1
N$75: Q7.B R110.2
N$76: J16.P3 R108.1
N$77: Q5.B R108.2
N$78: J11.P3 R109.1
N$79: Q6.B R109.2
PROC_ADC: UC1.17(PA7/SPI1_MOSI/ADC12_IN7/TIM3_CH2) ; also sheet 1,2,5
RANGE_SW: SW4.3(S) SW4.4(S1) UC1.11(PA1/USART2_RTS/ADC12_IN1/TIM2_CH2) ; also sheet 1
RESET: JTAG1.10 UC1.7(NRST) ; also sheet 1
RX: UC1.31(PA10/USART1_RX/TIM1_CH3) ; also sheet 1
SHAPE_ADC: UC1.15(PA5/SPI1_SCK/ADC12_IN5) ; also sheet 1,2,5
START: Q7.C R98.1 UC1.22(PB11/I2C2_SDA/USART3_RX) ; also sheet 1
TRIGGIN_B: J10.P2 ; also sheet 2
TX: UC1.30(PA9/USART1_TX/TIM1_CH2) ; also sheet 1
UNI: IC9.4(OUTA) ; also sheet 1,2,5
VCC: R104.2 R105.2 ; also sheet 1,2,3,5,6,7
VOCT_ADC: UC1.13(PA3/USART2_RX/ADC12_IN3/TIM2_CH4) ; also sheet 1,2,5
Unconnected: J24.P2 J25.P2 JTAG1.7 UC1.2(PC13-TAMPER-RTC) UC1.3(PC14-OSC32_IN) UC1.4(PC15-OSC32_OUT) UC1.27(PB14/SPI2_MISO/USART3_RTS/TIM1_CH2N) UC1.29(PA8/USART1_CK/TIM1_CH1/MCO)

### Notes on the sheet
- mini JTAG
- Mangu Díaz 2020
- cc-by-sa | Digital section
- Émilie  Gillet
- ol.gillet@gmail.com

## Sheet 5 of 7
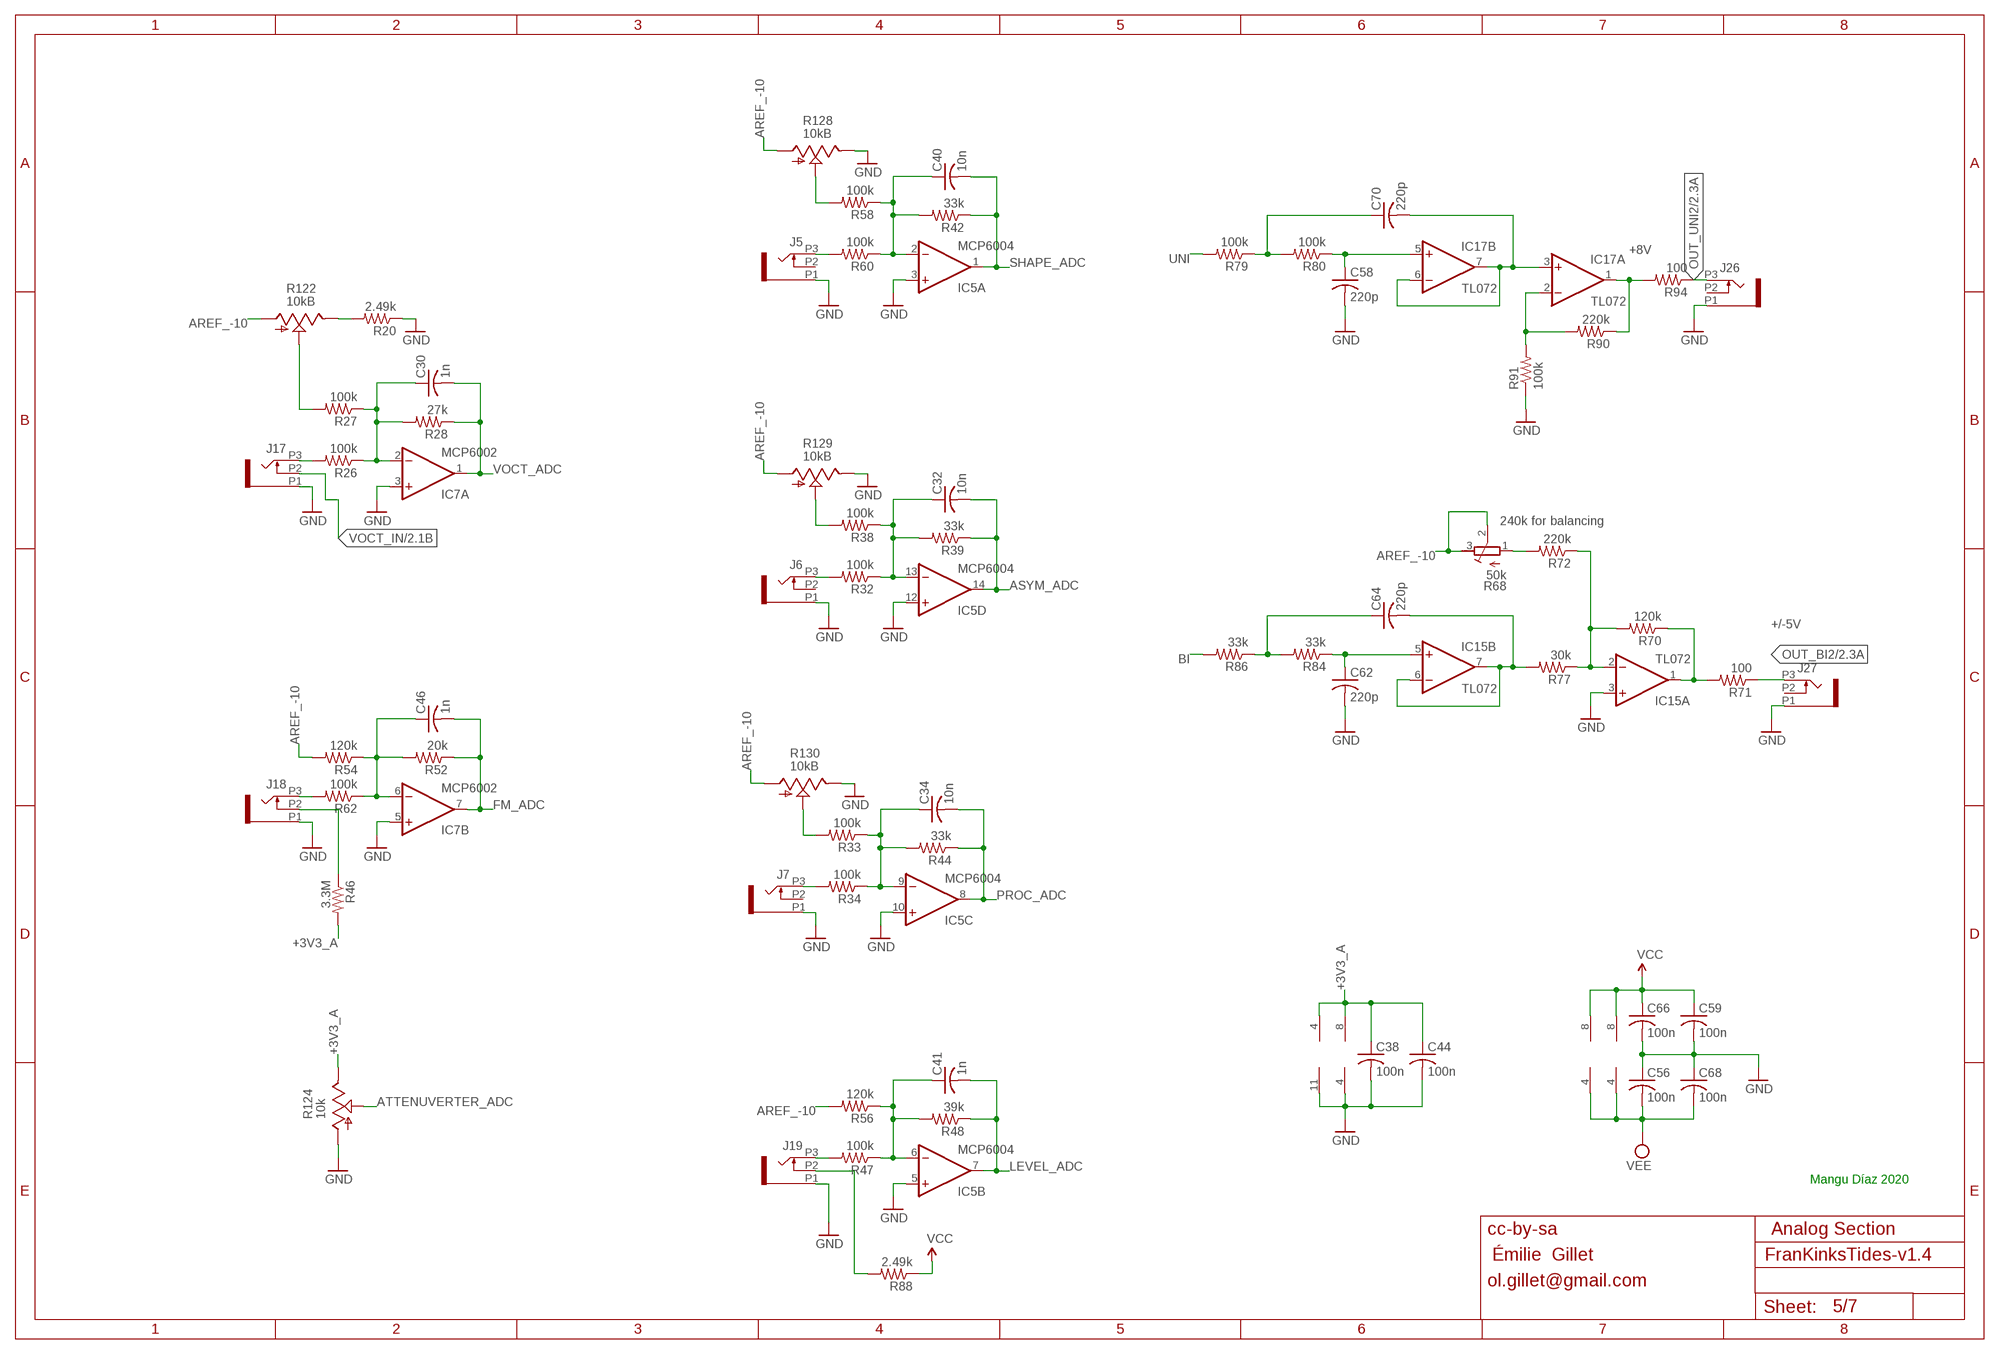
[diagram p4: schematic, sheet 5]

### Parts
C30  1n  C-USC0603  [C0603]
C32  10n  C-USC0603  [C0603]
C34  10n  C-USC0603  [C0603]
C38  100n  C-USC0603  [C0603]
C40  10n  C-USC0603  [C0603]
C41  1n  C-USC0603  [C0603]
C44  100n  C-USC0603  [C0603]
C46  1n  C-USC0603  [C0603]
C56  100n  C-USC0603  [C0603]
C58  220p  C-USC0603  [C0603]
C59  100n  C-USC0603  [C0603]
C62  220p  C-USC0603  [C0603]
C64  220p  C-USC0603  [C0603]
C66  100n  C-USC0603  [C0603]
C68  100n  C-USC0603  [C0603]
C70  220p  C-USC0603  [C0603]
IC5  MCP6004  MCP6004ST  [TSSOP14]
IC7  MCP6002  TL072D  [SO08]
IC15  TL072  TL072TSSOP  [TSSOP-8]
IC17  TL072  TL072TSSOP  [TSSOP-8]
J5  PJ301_GUI6  [OG-PJ301_VARIATIONS_WQP_PJ_301M6]
J6  PJ301_GUI6  [OG-PJ301_VARIATIONS_WQP_PJ_301M6]
J7  PJ301_GUI6  [OG-PJ301_VARIATIONS_WQP_PJ_301M6]
J17  PJ301_GUI6  [OG-PJ301_VARIATIONS_WQP_PJ_301M6]
J18  PJ301_GUI6  [OG-PJ301_VARIATIONS_WQP_PJ_301M6]
J19  PJ301_GUI6  [OG-PJ301_VARIATIONS_WQP_PJ_301M6]
J26  PJ301_GUI6  [OG-PJ301_VARIATIONS_WQP_PJ_301M6]
J27  PJ301_GUI6  [OG-PJ301_VARIATIONS_WQP_PJ_301M6]
R20  2.49k  R-US_R0603  [R0603]
R26  100k  R-US_R0603  [R0603]
R27  100k  R-US_R0603  [R0603]
R28  27k  R-US_R0603  [R0603]
R32  100k  R-US_R0603  [R0603]
R33  100k  R-US_R0603  [R0603]
R34  100k  R-US_R0603  [R0603]
R38  100k  R-US_R0603  [R0603]
R39  33k  R-US_R0603  [R0603]
R42  33k  R-US_R0603  [R0603]
R44  33k  R-US_R0603  [R0603]
R46  3.3M  R-US_R0603  [R0603]
R47  100k  R-US_R0603  [R0603]
R48  39k  R-US_R0603  [R0603]
R52  20k  R-US_R0603  [R0603]
R54  120k  R-US_R0603  [R0603]
R56  120k  R-US_R0603  [R0603]
R58  100k  R-US_R0603  [R0603]
R60  100k  R-US_R0603  [R0603]
R62  100k  R-US_R0603  [R0603]
R68  50k  R-TRIMM3296W  [RTRIM3296W]
R70  120k  R-US_R0603  [R0603]
R71  100  R-US_R0603  [R0603]
R72  220k  R-US_R0603  [R0603]
R77  30k  R-US_R0603  [R0603]
R79  100k  R-US_R0603  [R0603]
R80  100k  R-US_R0603  [R0603]
R84  33k  R-US_R0603  [R0603]
R86  33k  R-US_R0603  [R0603]
R88  2.49k  R-US_R0805  [R0805]
R90  220k  R-US_R0603  [R0603]
R91  100k  R-US_R0603  [R0603]
R94  100  R-US_R0603  [R0603]
R122  10kB  POT_USVERTICAL_PS  [ALPS_POT_VERTICAL_PS]
R124  10k  POT-ALPS_POT_US  [TALLTRIMMER]
R128  10kB  POT-ALPS_POT_US  [TALLTRIMMER]
R129  10kB  POT-ALPS_POT_US  [TALLTRIMMER]
R130  10kB  POT-ALPS_POT_US  [TALLTRIMMER]

### Nets
+3V3_A: C38.1 C44.1 IC5.4(P:V+) IC7.8(P:V+) R46.2 R124.P$1(E) ; also sheet 1,2,3,4,6
AREF_-10: R54.2 R56.2 R68.2(S) R68.3(E) R122.P$3(A) R128.P$3(A) R129.P$3(A) R130.P$3(A) ; also sheet 2,3,6
ASYM_ADC: C32.2 IC5.14(D:OUT) R39.1 ; also sheet 1,2,4
ATTENUVERTER_ADC: R124.P$2(S) ; also sheet 1,2,4
BI: R86.2 ; also sheet 1,2,4
BI_OUT1: IC15.1(A:OUT) R70.1 R71.2
F_CV1: IC15.2(A:-IN) R70.2 R72.1 R77.1
FM_ADC: C46.2 IC7.7(B:OUT) R52.1 ; also sheet 1,2,4
GND: C38.2 C44.2 C56.1 C58.2 C59.2 C62.2 C66.2 C68.1 IC5.3(A:+IN) IC5.5(B:+IN) IC5.10(C:+IN) IC5.11(P:V-) IC5.12(D:+IN) IC7.3(A:+IN) IC7.4(P:V-) IC7.5(B:+IN) IC15.3(A:+IN) J5.P1 J6.P1 J7.P1 J17.P1 J18.P1 J19.P1 J26.P1 J27.P1 R20.1 R91.1 R124.P$3(A) R128.P$1(E) R129.P$1(E) R130.P$1(E) ; also sheet 1,2,3,4,6,7
LEVEL_ADC: C41.2 IC5.7(B:OUT) R48.1 ; also sheet 1,2,4
N$80: J5.P3 R60.2
N$81: C40.1 IC5.2(A:-IN) R42.2 R58.1 R60.1
N$82: R58.2 R128.P$2(S)
N$83: J6.P3 R32.2
N$84: C32.1 IC5.13(D:-IN) R32.1 R38.1 R39.2
N$85: R38.2 R129.P$2(S)
N$86: J7.P3 R34.2
N$87: C34.1 IC5.9(C:-IN) R33.1 R34.1 R44.2
N$88: R33.2 R130.P$2(S)
N$89: J19.P3 R47.2
N$90: C41.1 IC5.6(B:-IN) R47.1 R48.2 R56.1
N$91: J17.P3 R26.2
N$92: C30.1 IC7.2(A:-IN) R26.1 R27.1 R28.2
N$93: R27.2 R122.P$2(S)
N$94: R20.2 R122.P$1(E)
N$95: J18.P3 R62.2
N$96: C46.1 IC7.6(B:-IN) R52.2 R54.1 R62.1
N$97: C70.2 IC17.3(A:+IN) IC17.6(B:-IN) IC17.7(B:OUT)
N$98: C58.1 IC17.5(B:+IN) R80.1
N$99: C70.1 R79.1 R80.2
N$100: IC17.2(A:-IN) R90.2 R91.2
N$101: C64.2 IC15.6(B:-IN) IC15.7(B:OUT) R77.2
N$102: C62.1 IC15.5(B:+IN) R84.1
N$103: C64.1 R84.2 R86.1
N$104: J18.P2 R46.1
N$106: IC17.1(A:OUT) R90.1 R94.2
N$107: R68.1(A) R72.2
N$108: J19.P2 R88.2
OUT_BI2: J27.P3 R71.1 ; also sheet 2
OUT_UNI2: J26.P3 R94.1 ; also sheet 2
PROC_ADC: C34.2 IC5.8(C:OUT) R44.1 ; also sheet 1,2,4
SHAPE_ADC: C40.2 IC5.1(A:OUT) R42.1 ; also sheet 1,2,4
UNI: R79.2 ; also sheet 1,2,4
VCC: C59.1 C66.1 IC15.8(P:V+) IC17.8(P:V+) R88.1 ; also sheet 1,2,3,4,6,7
VEE: C56.2 C68.2 IC15.4(P:V-) IC17.4(P:V-) ; also sheet 2,3,6,7
VOCT_ADC: C30.2 IC7.1(A:OUT) R28.1 ; also sheet 1,2,4
VOCT_IN: J17.P2 ; also sheet 2
Unconnected: J5.P2 J6.P2 J7.P2 J26.P2 J27.P2

### Notes on the sheet
- +8V
- 240k for balancing
- +/-5V
- Mangu Díaz 2020
- cc-by-sa | Analog Section
- Émilie  Gillet
- ol.gillet@gmail.com

## Sheet 6 of 7
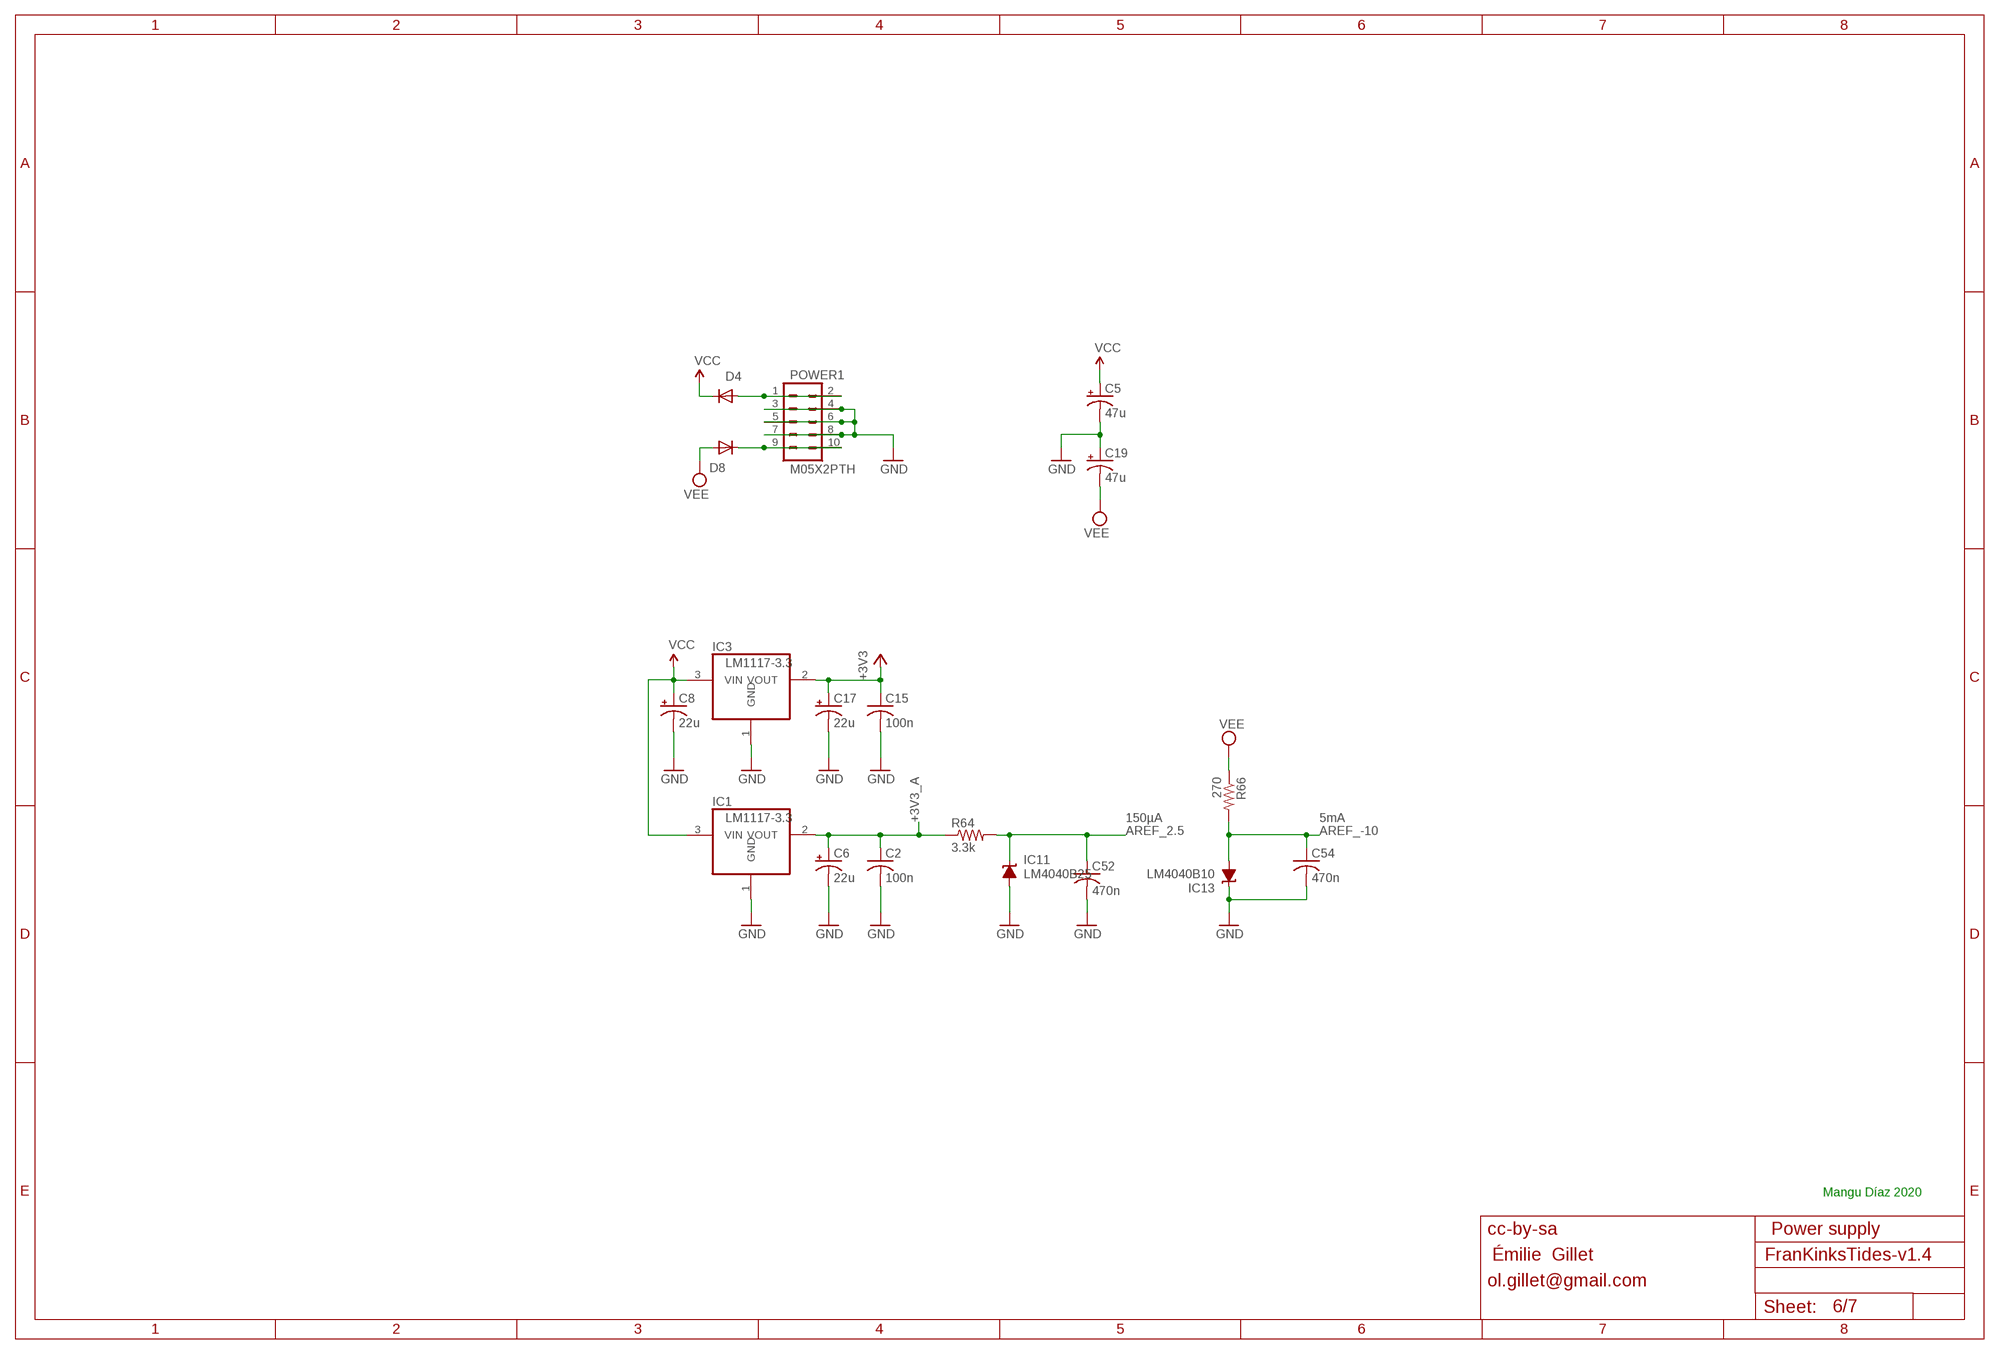
[diagram p5: schematic, sheet 6]

### Parts
C2  100n  C-USC0603  [C0603]
C5  47u  CPOL-USD  [PANASONIC_D]
C6  22u  CPOL-USD  [PANASONIC_D]
C8  22u  CPOL-USD  [PANASONIC_D]
C15  100n  C-USC0603  [C0603]
C17  22u  CPOL-USD  [PANASONIC_D]
C19  47u  CPOL-USD  [PANASONIC_D]
C52  470n  C-USC0603  [C0603]
C54  470n  C-USC0603  [C0603]
D4  1N5819HW  DIODE-SOD123  [SOD123]
D8  1N5819HW  DIODE-SOD123  [SOD123]
IC1  LM1117-3.3  REG1117  [SOT223]
IC3  LM1117-3.3  REG1117  [SOT223]
IC11  LM4040B25  LM4041B12DBZ  [DBZ_R-PDSO-G3]
IC13  LM4040B10  LM4041B12DBZ  [DBZ_R-PDSO-G3]
POWER1  M05X2PTH  [AVR_ICSP]
R64  3.3k  R-US_R0603  [R0603]
R66  270  R-US_R0603  [R0603]

### Nets
+3V3: C15.1 C17.+ IC3.2(VOUT) ; also sheet 1,3,4
+3V3_A: C2.1 C6.+ IC1.2(VOUT) R64.1 ; also sheet 1,2,3,4,5
AREF_2.5: C52.1 IC11.1(C) R64.2 ; also sheet 1,3,4
AREF_-10: C54.1 IC13.2(A) R66.2 ; also sheet 2,3,5
GND: C2.2 C5.- C6.- C8.- C15.2 C17.- C19.+ C52.2 C54.2 IC1.1(GND) IC3.1(GND) IC11.2(A) IC13.1(C) POWER1.3 POWER1.4 POWER1.5 POWER1.6 POWER1.7 POWER1.8 ; also sheet 1,2,3,4,5,7
N$109: D4.A POWER1.1 POWER1.2
N$110: D8.C POWER1.9 POWER1.10
VCC: C5.+ C8.+ D4.C IC1.3(VIN) IC3.3(VIN) ; also sheet 1,2,3,4,5,7
VEE: C19.- D8.A R66.1 ; also sheet 2,3,5,7

### Notes on the sheet
- 150µA | 5mA
- Mangu Díaz 2020
- cc-by-sa | Power supply
- Émilie  Gillet
- ol.gillet@gmail.com

## Sheet 7 of 7
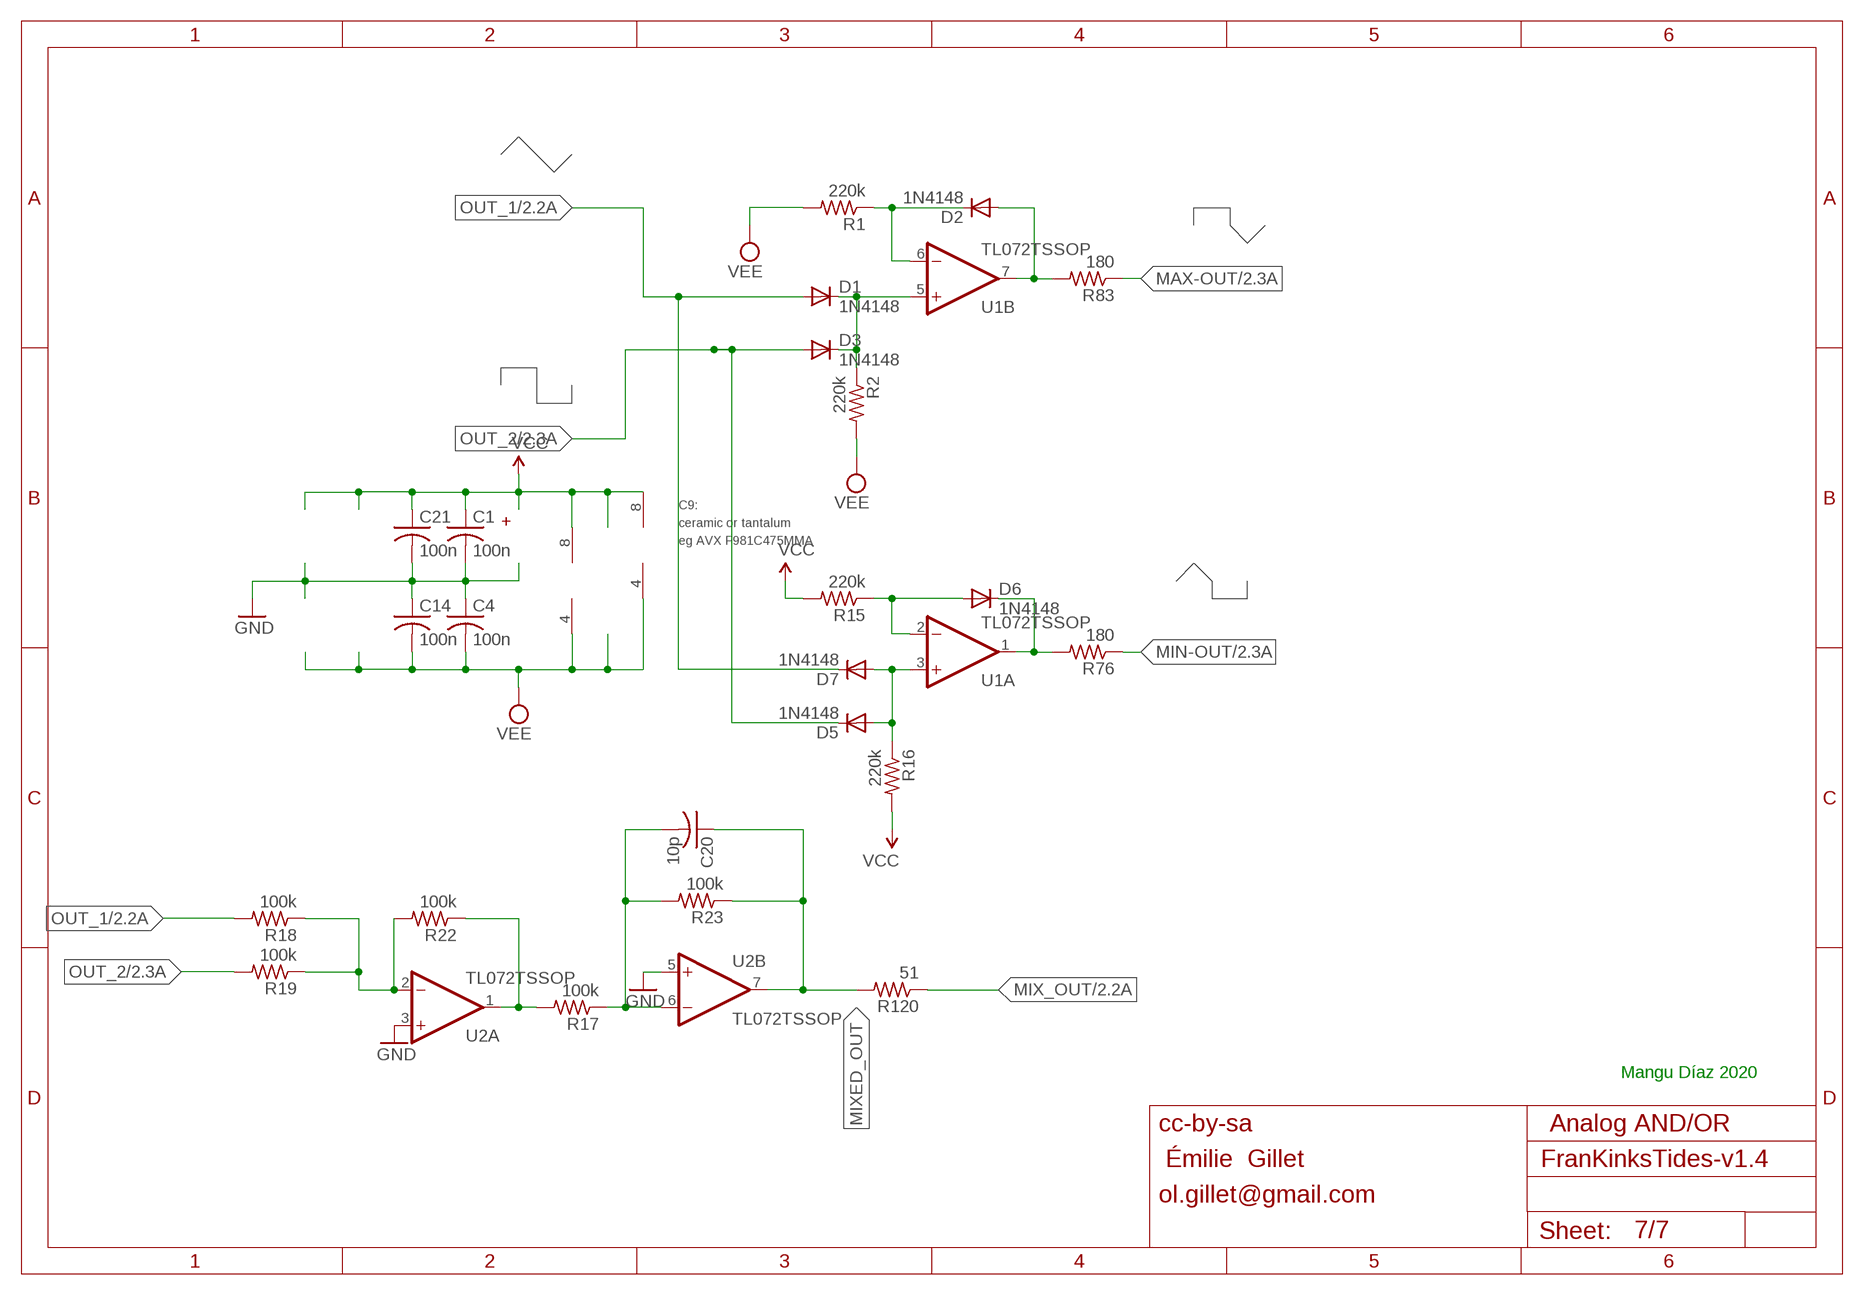
[diagram p6: schematic, sheet 7]

### Parts
C1  100n  C-USC0603  [C0603]
C4  100n  C-USC0603  [C0603]
C14  100n  C-USC0603  [C0603]
C20  10p  C-USC0603  [C0603]
C21  100n  C-USC0603  [C0603]
D1  1N4148  DIODE-SOD123  [SOD123]
D2  1N4148  DIODE-SOD123  [SOD123]
D3  1N4148  DIODE-SOD123  [SOD123]
D5  1N4148  DIODE-SOD123  [SOD123]
D6  1N4148  DIODE-SOD123  [SOD123]
D7  1N4148  DIODE-SOD123  [SOD123]
R1  220k  R-US_R0603  [R0603]
R2  220k  R-US_R0603  [R0603]
R15  220k  R-US_R0603  [R0603]
R16  220k  R-US_R0603  [R0603]
R17  100k  R-US_R0603  [R0603]
R18  100k  R-US_R0603  [R0603]
R19  100k  R-US_R0603  [R0603]
R22  100k  R-US_R0603  [R0603]
R23  100k  R-US_R0603  [R0603]
R76  180  R-US_R0603  [R0603]
R83  180  R-US_R0603  [R0603]
R120  51  R-US_R0603  [R0603]
U1  TL072TSSOP  [TSSOP-8]
U2  TL072TSSOP  [TSSOP-8]

### Nets
GND: C1.2 C4.1 C14.1 C21.2 U2.3(A:+IN) U2.5(B:+IN) ; also sheet 1,2,3,4,5,6
MAX-OUT: R83.1 ; also sheet 2
MIN-OUT: R76.1 ; also sheet 2
MIX_OUT: R120.1 ; also sheet 2
MIXED_OUT: C20.1 R23.1 R120.2 U2.7(B:OUT)
N$52: R17.2 R22.1 U2.1(A:OUT)
N$54: D1.C D3.C R2.1 U1.5(B:+IN)
N$56: D2.A R83.2 U1.7(B:OUT)
N$57: C20.2 R17.1 R23.2 U2.6(B:-IN)
N$64: R18.1 R19.1 R22.2 U2.2(A:-IN)
N$105: D2.C R1.1 U1.6(B:-IN)
N$111: D5.A D7.A R16.1 U1.3(A:+IN)
N$112: D6.C R76.2 U1.1(A:OUT)
N$113: D6.A R15.1 U1.2(A:-IN)
OUT_1: D1.A D7.C R18.2 ; also sheet 2
OUT_2: D3.A D5.C R19.2 ; also sheet 2
VCC: C1.1 C21.1 R15.2 R16.2 U1.8(P:V+) U2.8(P:V+) ; also sheet 1,2,3,4,5,6
VEE: C4.2 C14.2 R1.2 R2.2 U1.4(P:V-) U2.4(P:V-) ; also sheet 2,3,5,6

### Notes on the sheet
- C9:
- + | ceramic or tantalum
- eg AVX F981C475MMA
- Mangu Díaz 2020
- cc-by-sa | Analog AND/OR
- Émilie  Gillet
- ol.gillet@gmail.com

## Library data of the parts
C1-C4 C10-C16 C20-C71 = rcl:C-US: CAPACITOR, American symbol
C5-C9 C17-C19 = rcl:CPOL-US: POLARIZED CAPACITOR, American symbol
D1-D8 = diode:DIODE-: DIODE
FM-A SYNC-A SYNC-B = Mangu:SUBMINI_SPDT
IC1-IC4 = og-vreg:REG1117: 800mA and 1A Low Dropout (LDO) Positive Regulator 1.8V, 2.5V, 2.85V, 3.3V, 5V, and Adj
IC5 IC6 = linear:MCP6004: Quad Op Amp
IC7 IC8 = linear:TL072: OP AMP
IC9 IC10 = og-dac:DAC8552
IC11-IC14 = texas:LM4041: PRECISION MICROPOWER SHUNT VOLTAGE REFERENCE Source: http://focus.ti.com/lit/ds/slcs146e/slcs146e.pdf
IC15-IC18 = MusicThingModular:TL072: Generic Dual Op Amp
J1-J27 MAX MIN MIX = MILibuTides5:PJ301_GUI
JTAG JTAG1 POWER1 = og-header:M05X2: Header 5x2 Standard 10-pin dual row 0.1" header. Commonly used with AVR-ISP. Use with Spark Fun Electronics SKU: PRT-00778
LED1-LED6 = og-leds:LED-BICOLOR-THROUGHHOLE
Q1 Q2 = SparkFun-Clocks:CRYSTAL-8MHZ: 8MHz Crystal Datasheet Example <http://www.futureelectronics.com/en/technologies/electromechanical/timing-devices/crystals/Pages/6008189-ABM3B-8.000MHZ-B2-T.aspx?IM=0> Frequency: 8MHz Frequency Tolerance: ±20ppm Load Capacitance: 18pF SparkFun Products: Pro Micro -3.3V/8MHz <https://www.sparkfun.com/products/12587> WAV Trigger <https://www.sparkfun.com/products/13660>; PROD_ID: XTAL-11706
Q3-Q12 = transistor:*-NPN-: NPN Transistror BF959 corrected 2008.03.06
R1-R67 R70-R120 R131 R132 = rcl:R-US_: RESISTOR, American symbol
R68 R69 = rcl:R-TRIMM: Trimm resistor
R121 R122 = pot-alps:POT_US
R123-R130 = MILibuTides5:POT-ALPS_POT_US
SW1-SW4 = switch-e-switch:TL1100X: TACTILE SWITCH
U1 U2 = Mangu:TL072: Generic Dual Op Amp
UC1 UC2 = stm32:STM32F103CB
UNI-BI = switch:TL49PO: TINY SWITCH ON OFF ON Source: http://www2.produktinfo.conrad.com/datenblaetter/700000-724999/705152-da-01-de-Subminiaturschalter_TL_36YO.pdf
VR1 = Mangu:ALPHA-9MM-DUALPOT: 9mm vertical snap-in pot, Alpha / Panasonic style, with a connection to the metal chassis for grounding